# EAGLE design spi (EAGLE 9.6.2)

## Sheet 1 of 2: to spi
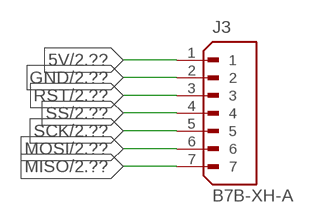
[diagram p0: schematic, sheet 1]

### Parts
J3  B7B-XH-A  [JST_B7B-XH-A]

### Nets
5V: J3.1 ; also sheet 2
GND: J3.2 ; also sheet 2
MISO: J3.7 ; also sheet 2
MOSI: J3.6 ; also sheet 2
RST: J3.3 ; also sheet 2
SCK: J3.5 ; also sheet 2
SS: J3.4 ; also sheet 2

## Sheet 2 of 2
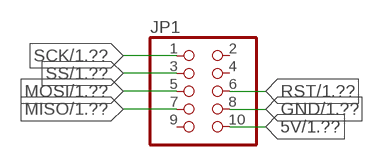
[diagram p1: schematic, sheet 2]

### Parts
JP1  PINHD-2X5  [2X05]

### Nets
5V: JP1.10 ; also sheet 1
GND: JP1.8 ; also sheet 1
MISO: JP1.7 ; also sheet 1
MOSI: JP1.5 ; also sheet 1
RST: JP1.6 ; also sheet 1
SCK: JP1.1 ; also sheet 1
SS: JP1.3 ; also sheet 1
Unconnected: JP1.2 JP1.4 JP1.9

## Library data of the parts
J3 = data-cable(7-pin):B7B-XH-A: Check availability <https://pricing.snapeda.com/parts/B7B-XH-A/JST%20Sales/view-part?ref=eda>; AVAILABILITY: In Stock; CHECK_PRICES: https://www.snapeda.com/parts/B7B-XH-A/JST/view-part/?ref=eda; DESCRIPTION: Connector Header Through Hole 7 position 0.098 (2.50mm); MF: JST Sales; MP: B7B-XH-A; PACKAGE: None; PRICE: None; SNAPEDA_LINK: https://www.snapeda.com/parts/B7B-XH-A/JST/view-part/?ref=snap
JP1 = pinhead:PINHD-2X5: PIN HEADER

## Board
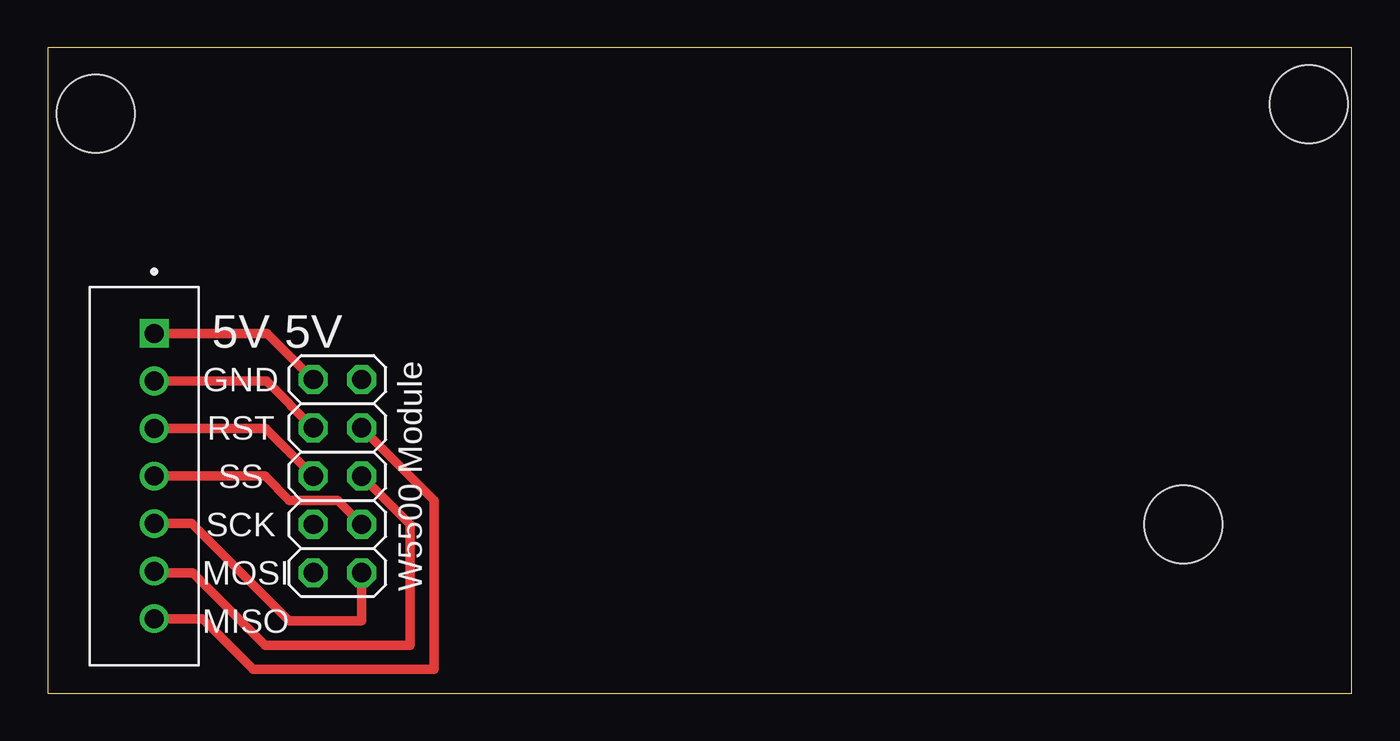
[diagram p2: board, top side]

Size 68.56 x 33.96 mm. Coordinates in mm from the lower left corner, seen from the top.
Outline: 0,0 68.56,0 68.56,33.96 0,33.96 0,0
Copper layers (1*16): Top 0.035mm / dielectric 1.5mm / Bottom 0.035mm
Design rules "default": minimum track width 6mil, minimum drill 0.35mm, track to track 6mil, track to pad 6mil, pad to pad 6mil, via to via 6mil, smd to smd 6mil, copper to edge 40mil, drill to drill 6mil, minimum pad ring 10mil, minimum via ring 8mil, stop-mask expansion 4mil, vias tented up to drill 0mil, thermal gap 10mil
Holes 4.1 mm at 2.54,30.48 66.29,30.99 59.69,8.89

### Footprints (pad centres in the part's own frame; a part is rotated, then mirrored left to right if it is on the bottom)
JST_B7B-XH-A = drill 1 square: 1 7.5,-0.525 | drill 1: 2 5,-0.525; 3 2.5,-0.525; 4 0,-0.525; 5 -2.5,-0.525; 6 -5,-0.525; 7 -7.5,-0.525
2X05 = drill 1.016 octagon: 1 -5.08,-1.27; 2 -5.08,1.27; 3 -2.54,-1.27; 4 -2.54,1.27; 5 0,-1.27; 6 0,1.27; 7 2.54,-1.27; 8 2.54,1.27; 9 5.08,-1.27; 10 5.08,1.27

### Placement (x,y rotation side)
J3  5.08,11.43 90 top
JP1  15.24,11.43 90 top

### Tracks (layer width: path | path; a pad name or v marks a point on that pad's centre or on a via)
5V
  Top 0.508: J3.1 11.55,18.93 JP1.10
GND
  Top 0.508: J3.2 11.51,16.43 JP1.8
MISO
  Top 0.508: J3.7 8.14,3.93 10.8,1.27 20.32,1.27 20.32,10.16 JP1.7
MOSI
  Top 0.508: JP1.5 19.05,8.89 19.05,2.54 11.43,2.54 7.62,6.35 5.68,6.35 J3.6
RST
  Top 0.508: J3.3 11.47,13.93 JP1.6
SCK
  Top 0.508: JP1.1 16.51,3.81 12.7,3.81 7.58,8.93 J3.5
SS
  Top 0.508: J3.4 11.43,11.43 12.7,10.16 15.24,10.16 JP1.3

### Text on the board
tPlace: 5V | 5V | GND | RST | SS | W5500 Module | SCK | MOSI | MISO